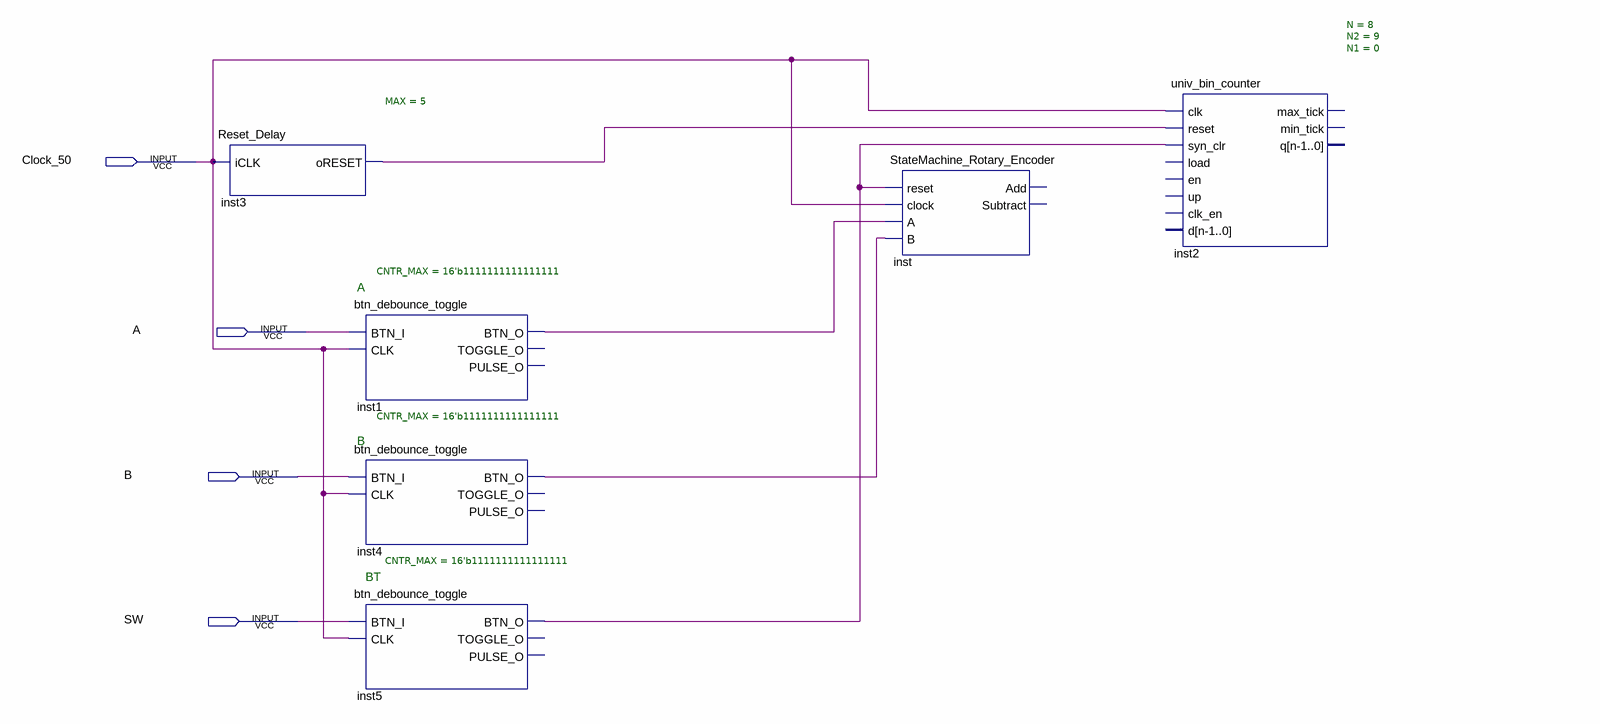
[diagram p0: schematic sheet]
// Quartus schematic Encoder_Lab3.bdf as structural Verilog: 6 symbols, 4 pins
module Encoder_Lab3 (
  input  Clock_50,
  input  A,
  input  B,
  input  SW
);

  wire inst1_btn_o, inst3_oreset, inst4_btn_o, inst5_btn_o;

  Reset_Delay #(.MAX(5)) inst3 (.iCLK(Clock_50), .oRESET(inst3_oreset));
  btn_debounce_toggle #(.CNTR_MAX(16'b1111111111111111)) inst1 (
    .BTN_I(A), .CLK(Clock_50), .BTN_O(inst1_btn_o));  // open: TOGGLE_O, PULSE_O
  btn_debounce_toggle #(.CNTR_MAX(16'b1111111111111111)) inst4 (
    .BTN_I(B), .CLK(Clock_50), .BTN_O(inst4_btn_o));  // open: TOGGLE_O, PULSE_O
  btn_debounce_toggle #(.CNTR_MAX(16'b1111111111111111)) inst5 (
    .BTN_I(SW), .CLK(Clock_50), .BTN_O(inst5_btn_o));  // open: TOGGLE_O, PULSE_O
  StateMachine_Rotary_Encoder inst (
    .reset(inst5_btn_o), .clock(Clock_50), .A(inst1_btn_o), .B(inst4_btn_o));  // open: Add, Subtract
  univ_bin_counter #(.N(8), .N2(9), .N1(0)) inst2 (
    .clk(Clock_50), .reset(inst3_oreset), .syn_clr(inst5_btn_o));  // open: load, en, up, clk_en, d, max_tick, min_tick, q

  // Notes on the sheet:
  //   A
  //   B
  //   BT
endmodule
